# EAGLE schematic Leak Detector v3 (EAGLE 6.5.0)
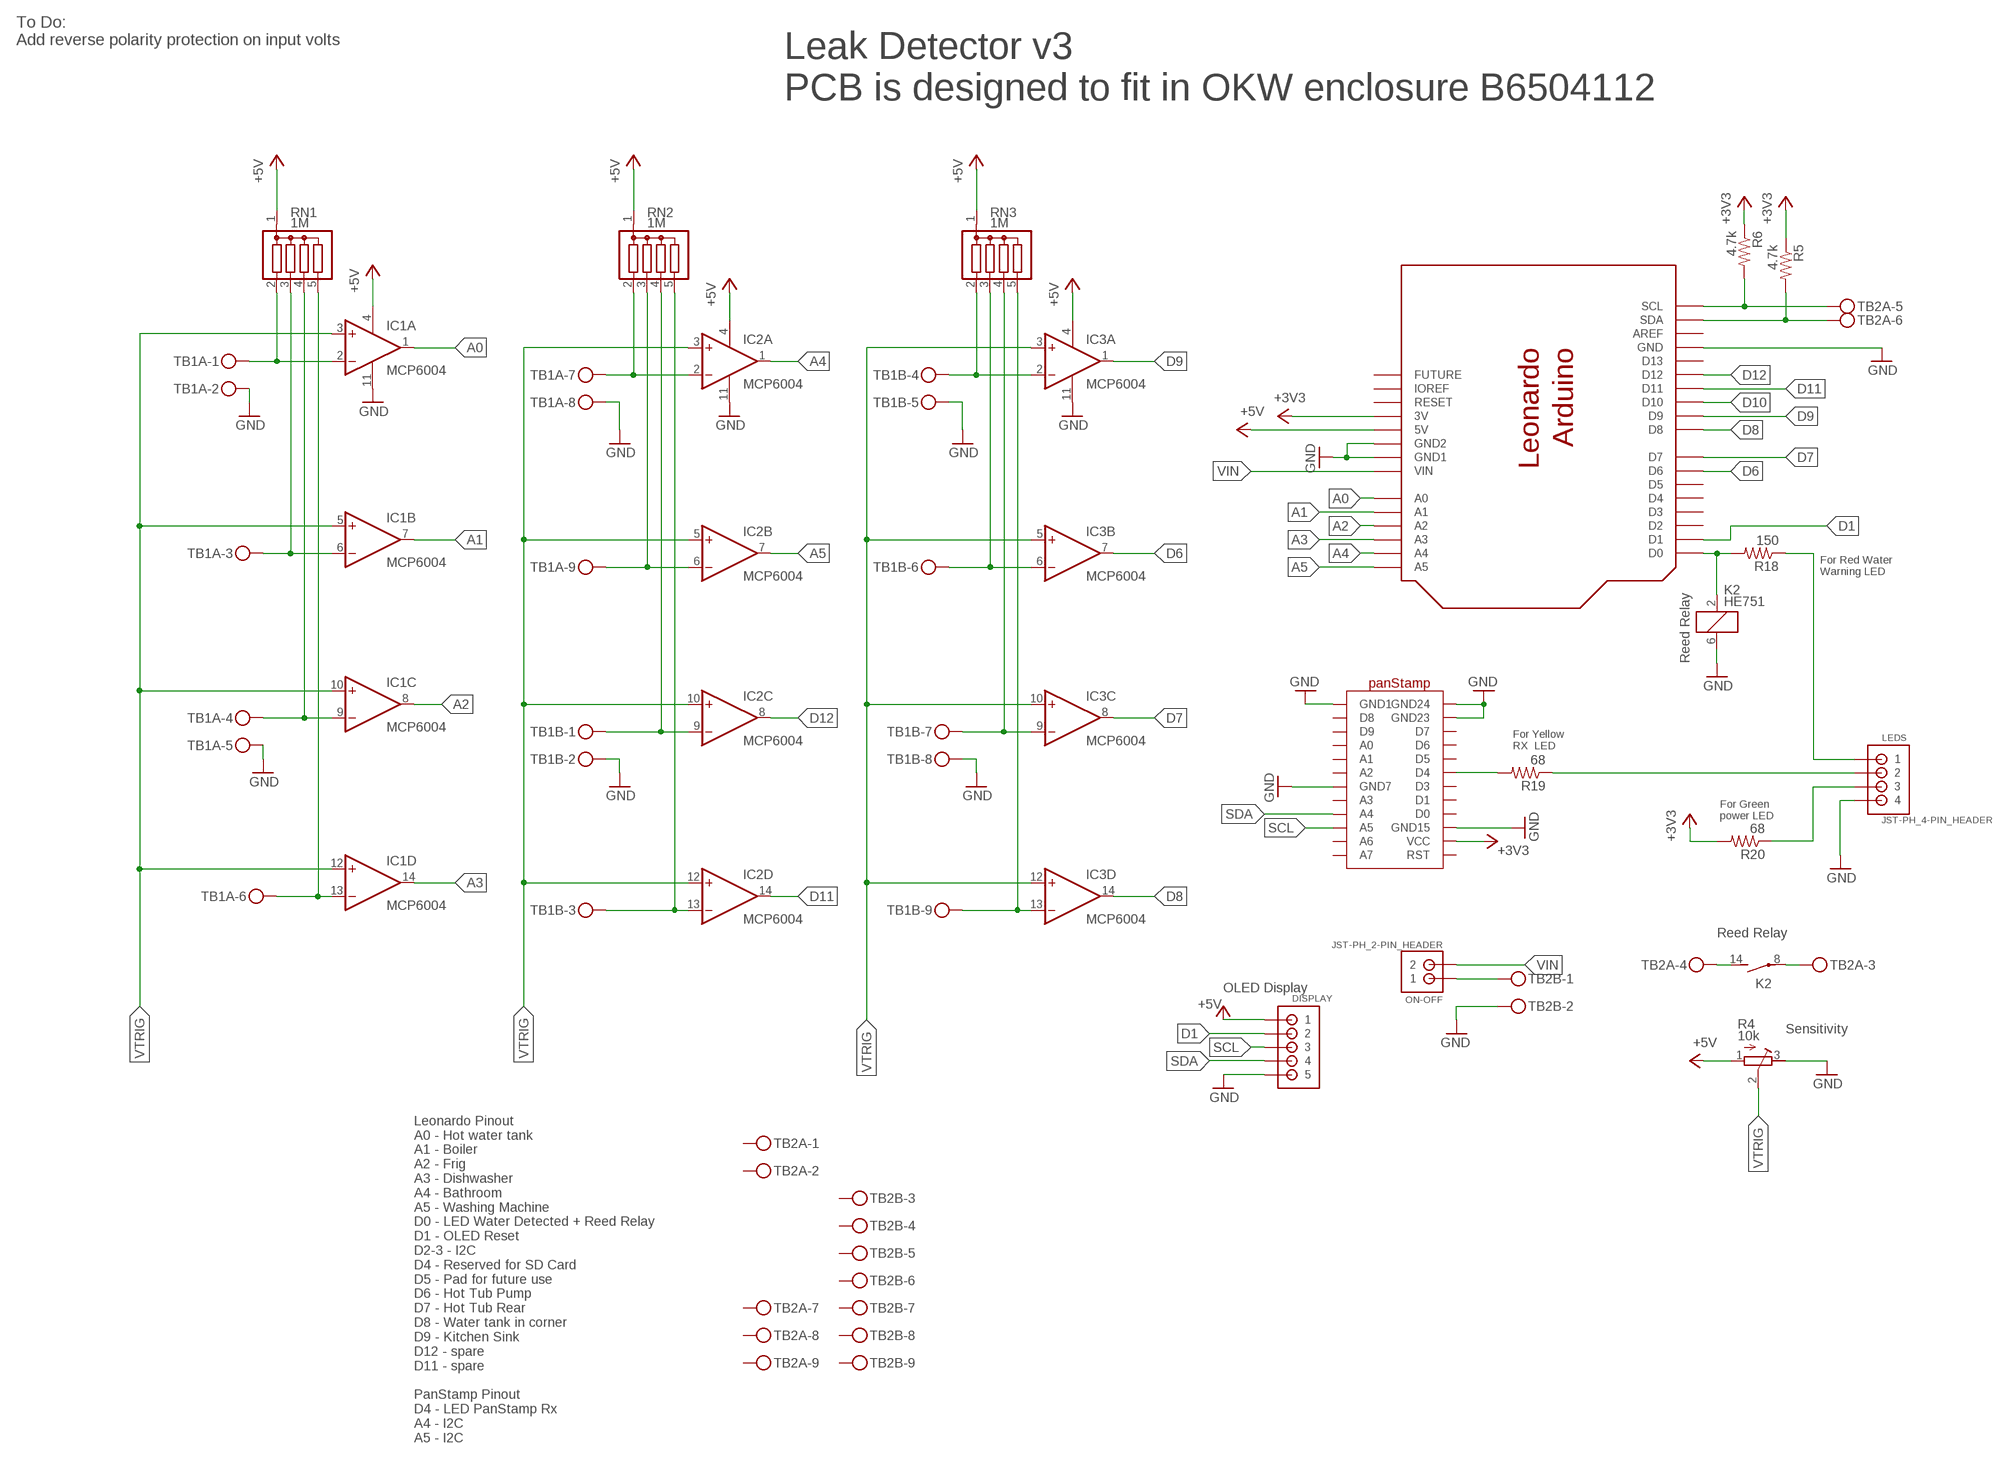
[diagram p0: schematic, sheet 1]

## Parts
DISPLAY  JST-PH_5-PIN_HEADER  [JST_B5B-PH_HEADER]
IC1  MCP6004  MCP604P  [DIL14]
IC2  MCP6004  MCP604P  [DIL14]
IC3  MCP6004  MCP604P  [DIL14]
K2  HE751  [HE751]
LEDS  JST-PH_4-PIN_HEADER  [JST_B4B-PH_HEADER]
ON-OFF  JST-PH_2-PIN_HEADER  [JST_B2B-PH_HEADER]
R4  10k  R-TRIMM3296P  [RTRIM3296P]
R5  4.7k  R-US_0207/10  [0207/10]
R6  4.7k  R-US_0207/10  [0207/10]
R18  150  R-US_0207/10  [0207/10]
R19  68  R-US_0207/10  [0207/10]
R20  68  R-US_0207/10  [0207/10]
RN1  1M  G04R  [SIL5]
RN2  1M  G04R  [SIL5]
RN3  1M  G04R  [SIL5]
TB1A  MKDSN1,5/9-5,08  [MKDSN1,5/9-5,08]
TB1B  MKDSN1,5/9-5,08  [MKDSN1,5/9-5,08]
TB2A  MKDSN1,5/9-5,08  [MKDSN1,5/9-5,08]
TB2B  MKDSN1,5/9-5,08  [MKDSN1,5/9-5,08]
U$1  ARDUINO_LEONARDO  [ARDUINO_LEONARDO]
U$2  PANSTAMP  [PANSTAMP]

## Nets
+3V3 [Power]: R5.1 R6.1 R20.2 U$1.3V U$2.VCC
+5V [Power]: DISPLAY.P1 IC1.4(P:V+) IC2.4(P:V+) IC3.4(P:V+) R4.1(E) RN1.1 RN2.1 RN3.1 U$1.5V
A0: IC1.1(A:OUT) U$1.A0
A1: IC1.7(B:OUT) U$1.A1
A2: IC1.8(C:OUT) U$1.A2
A3: IC1.14(D:OUT) U$1.A3
A4: IC2.1(A:OUT) U$1.A4
A5: IC2.7(B:OUT) U$1.A5
BATHROOM: IC2.2(A:-IN) RN2.2 TB1A.7
BOILER: IC1.6(B:-IN) RN1.3 TB1A.3
D1: DISPLAY.P2 U$1.D1
D6: IC3.7(B:OUT) U$1.D6
D7: IC3.8(C:OUT) U$1.D7
D8: IC3.14(D:OUT) U$1.D8
D9: IC3.1(A:OUT) U$1.D9
D10: U$1.D10
D11: IC2.14(D:OUT) U$1.D11
D12: IC2.8(C:OUT) U$1.D12
DISHWASHER: IC1.13(D:-IN) RN1.5 TB1A.6
FRIG: IC1.9(C:-IN) RN1.4 TB1A.4
GND [Power]: DISPLAY.P5 IC1.11(P:V-) IC2.11(P:V-) IC3.11(P:V-) K2.6 LEDS.P4 R4.3(A) TB1A.2 TB1A.5 TB1A.8 TB1B.2 TB1B.5 TB1B.8 TB2B.2 U$1.GND U$1.GND$2(GND2) U$1.GND$3(GND1) U$2.GND1 U$2.GND7 U$2.GND15 U$2.GND23 U$2.GND24
HAVEPOWER: LEDS.P3 R20.1
HOT_TUB_PUMP: IC3.6(B:-IN) RN3.3 TB1B.6
HOT_TUB_REAR: IC3.9(C:-IN) RN3.4 TB1B.7
HOT_WATER_TANK: IC1.2(A:-IN) RN1.2 TB1A.1
ISWATER: LEDS.P1 R18.1
N$1 [Power]: ON-OFF.P1 TB2B.1
N$2: K2.2 R18.2 U$1.D0
N$4: K2.14(2:S) TB2A.4
N$5: K2.8(2:P) TB2A.3
N$34: R19.2 U$2.D4
RXOK: LEDS.P2 R19.1
SCL: DISPLAY.P3 R6.2 TB2A.5 U$1.SCL U$2.A5
SDA: DISPLAY.P4 R5.2 TB2A.6 U$1.SDA U$2.A4
SINK: IC3.2(A:-IN) RN3.2 TB1B.4
SPARE1: IC2.9(C:-IN) RN2.4 TB1B.1
SPARE2: IC2.13(D:-IN) RN2.5 TB1B.3
VIN [Power]: ON-OFF.P2 U$1.VIN
VTRIG: IC1.3(A:+IN) IC1.5(B:+IN) IC1.10(C:+IN) IC1.12(D:+IN) IC2.3(A:+IN) IC2.5(B:+IN) IC2.10(C:+IN) IC2.12(D:+IN) IC3.3(A:+IN) IC3.5(B:+IN) IC3.10(C:+IN) IC3.12(D:+IN) R4.2(S)
WASH_MACH: IC2.6(B:-IN) RN2.3 TB1A.9
WATER_TANK: IC3.13(D:-IN) RN3.5 TB1B.9
Unconnected: TB2A.1 TB2A.2 TB2A.7 TB2A.8 TB2A.9 TB2B.3 TB2B.4 TB2B.5 TB2B.6 TB2B.7 TB2B.8 TB2B.9 U$1.AREF U$1.D2 U$1.D3 U$1.D4 U$1.D5 U$1.D13 U$1.IOREF U$1.RESERVED(FUTURE) U$1.RESET U$2.A0 U$2.A1 U$2.A2 U$2.A3 U$2.A6 U$2.A7 U$2.D0 U$2.D1 U$2.D3 U$2.D5 U$2.D6 U$2.D7 U$2.D8 U$2.D9 U$2.RESET(RST)

## Notes on the sheet
- To Do:
  Add reverse polarity protection on input volts
- Leak Detector v3
  PCB is designed to fit in OKW enclosure B6504112
- For Red Water
  Warning LED
- Reed Relay
- For Yellow 
  RX  LED
- For Green 
  power LED
- Reed Relay
- OLED Display
- Sensitivity
- Leonardo Pinout
  A0 - Hot water tank
  A1 - Boiler
  A2 - Frig
  A3 - Dishwasher
  A4 - Bathroom
  A5 - Washing Machine
  D0 - LED Water Detected + Reed Relay
  D1 - OLED Reset
  D2-3 - I2C 
  D4 - Reserved for SD Card
  D5 - Pad for future use
  D6 - Hot Tub Pump
  D7 - Hot Tub Rear
  D8 - Water tank in corner
  D9 - Kitchen Sink
  D12 - spare
  D11 - spare
  
  PanStamp Pinout
  D4 - LED PanStamp Rx 
  A4 - I2C
  A5 - I2C

## Library data of the parts
DISPLAY = SRG:JST-PH_5-PIN_HEADER: 5-pin JST PH Shrouded Header, top entry P/N B5B-PH-K-S Mating connector PHR-5
IC1-IC3 = linear:MCP604: Quad Op Amp 2.7V to 6.0V Single Supply CMOS Source: http://ww1.microchip.com/downloads/en/DeviceDoc/21314g.pdf
K2 = relay:HE751: RELAY reed, 1 x norm. open, Hamlin; OC_FARNELL: unknown; OC_NEWARK: unknown
LEDS = SRG:JST-PH_4-PIN_HEADER: 4-pin JST PH Shrouded Header, top entry P/N B4B-PH-K-S Mating connector PHR-4
ON-OFF = SRG:JST-PH_2-PIN_HEADER: 2-pin JST PH Shrouded Header, top entry P/N B2B-PH-K-S Mating connector PHR-2 Mating cable assembly: Sparkfun PRT-09914 <http://www.sparkfun.com/products/9914>
R4 = resistor:R-TRIMM: Trimm resistor
R5 R6 R18-R20 = rcl:R-US_: RESISTOR, American symbol
RN1-RN3 = resistor-sil:G04R: SIL RESISTOR; OC_FARNELL: unknown; OC_NEWARK: unknown
TB1A TB1B TB2A TB2B = con-phoenix-508:MKDSN1,5/9-5,08: MKDSN 1,5/ 9-5,08 Printklemme Nennstrom: 13,5 A Nennspannung: 250 V Rastermaß: 5,08 mm Polzahl: 9 Anschlussart: Schraubanschluss Montage: Löten Anschlussrichtung Leiter/Platine: 0 ° Artikelnummer: 1729199 Source: http://eshop.phoenixcontact.com .. 1729199.pdf; MPN: SMKDSN1,5/9-5,08; OC_FARNELL: 1792912; OC_NEWARK: 70R0305
U$1 = SRG:ARDUINO_LEONARDO: Arduino Leonardo I2C Pins: D2, D3 PWM Pins: D3, D5, D5, D11, D13 Interrup Pint: D2, D3 http://arduino.cc/en/Main/arduinoBoardLeonardo
U$2 = SRG:PANSTAMP: panStamp panStamps are small wireless modules programmable from the Arduino IDE. Each module contains an Atmega328p MCU and a Texas Instruments CC1101 RF interface, providing the necessary connectivity and processing power to create autonomous low-power wireless motes. Everything contained into a compact DIP-24 module. http://www.panstamp.com Vin: 2.5 to 3.6 volts A4 - SDA A5 - SCL PWM: D3,5,6,9,10,11 Interrupts: D2,3

## Net classes
0 default: width 0.305 mm, drill 0.508 mm, clearance 0.305 mm
1 Power: width 0.508 mm, drill 0.508 mm, clearance 0.305 mm